# EAGLE design led (EAGLE 5.07)
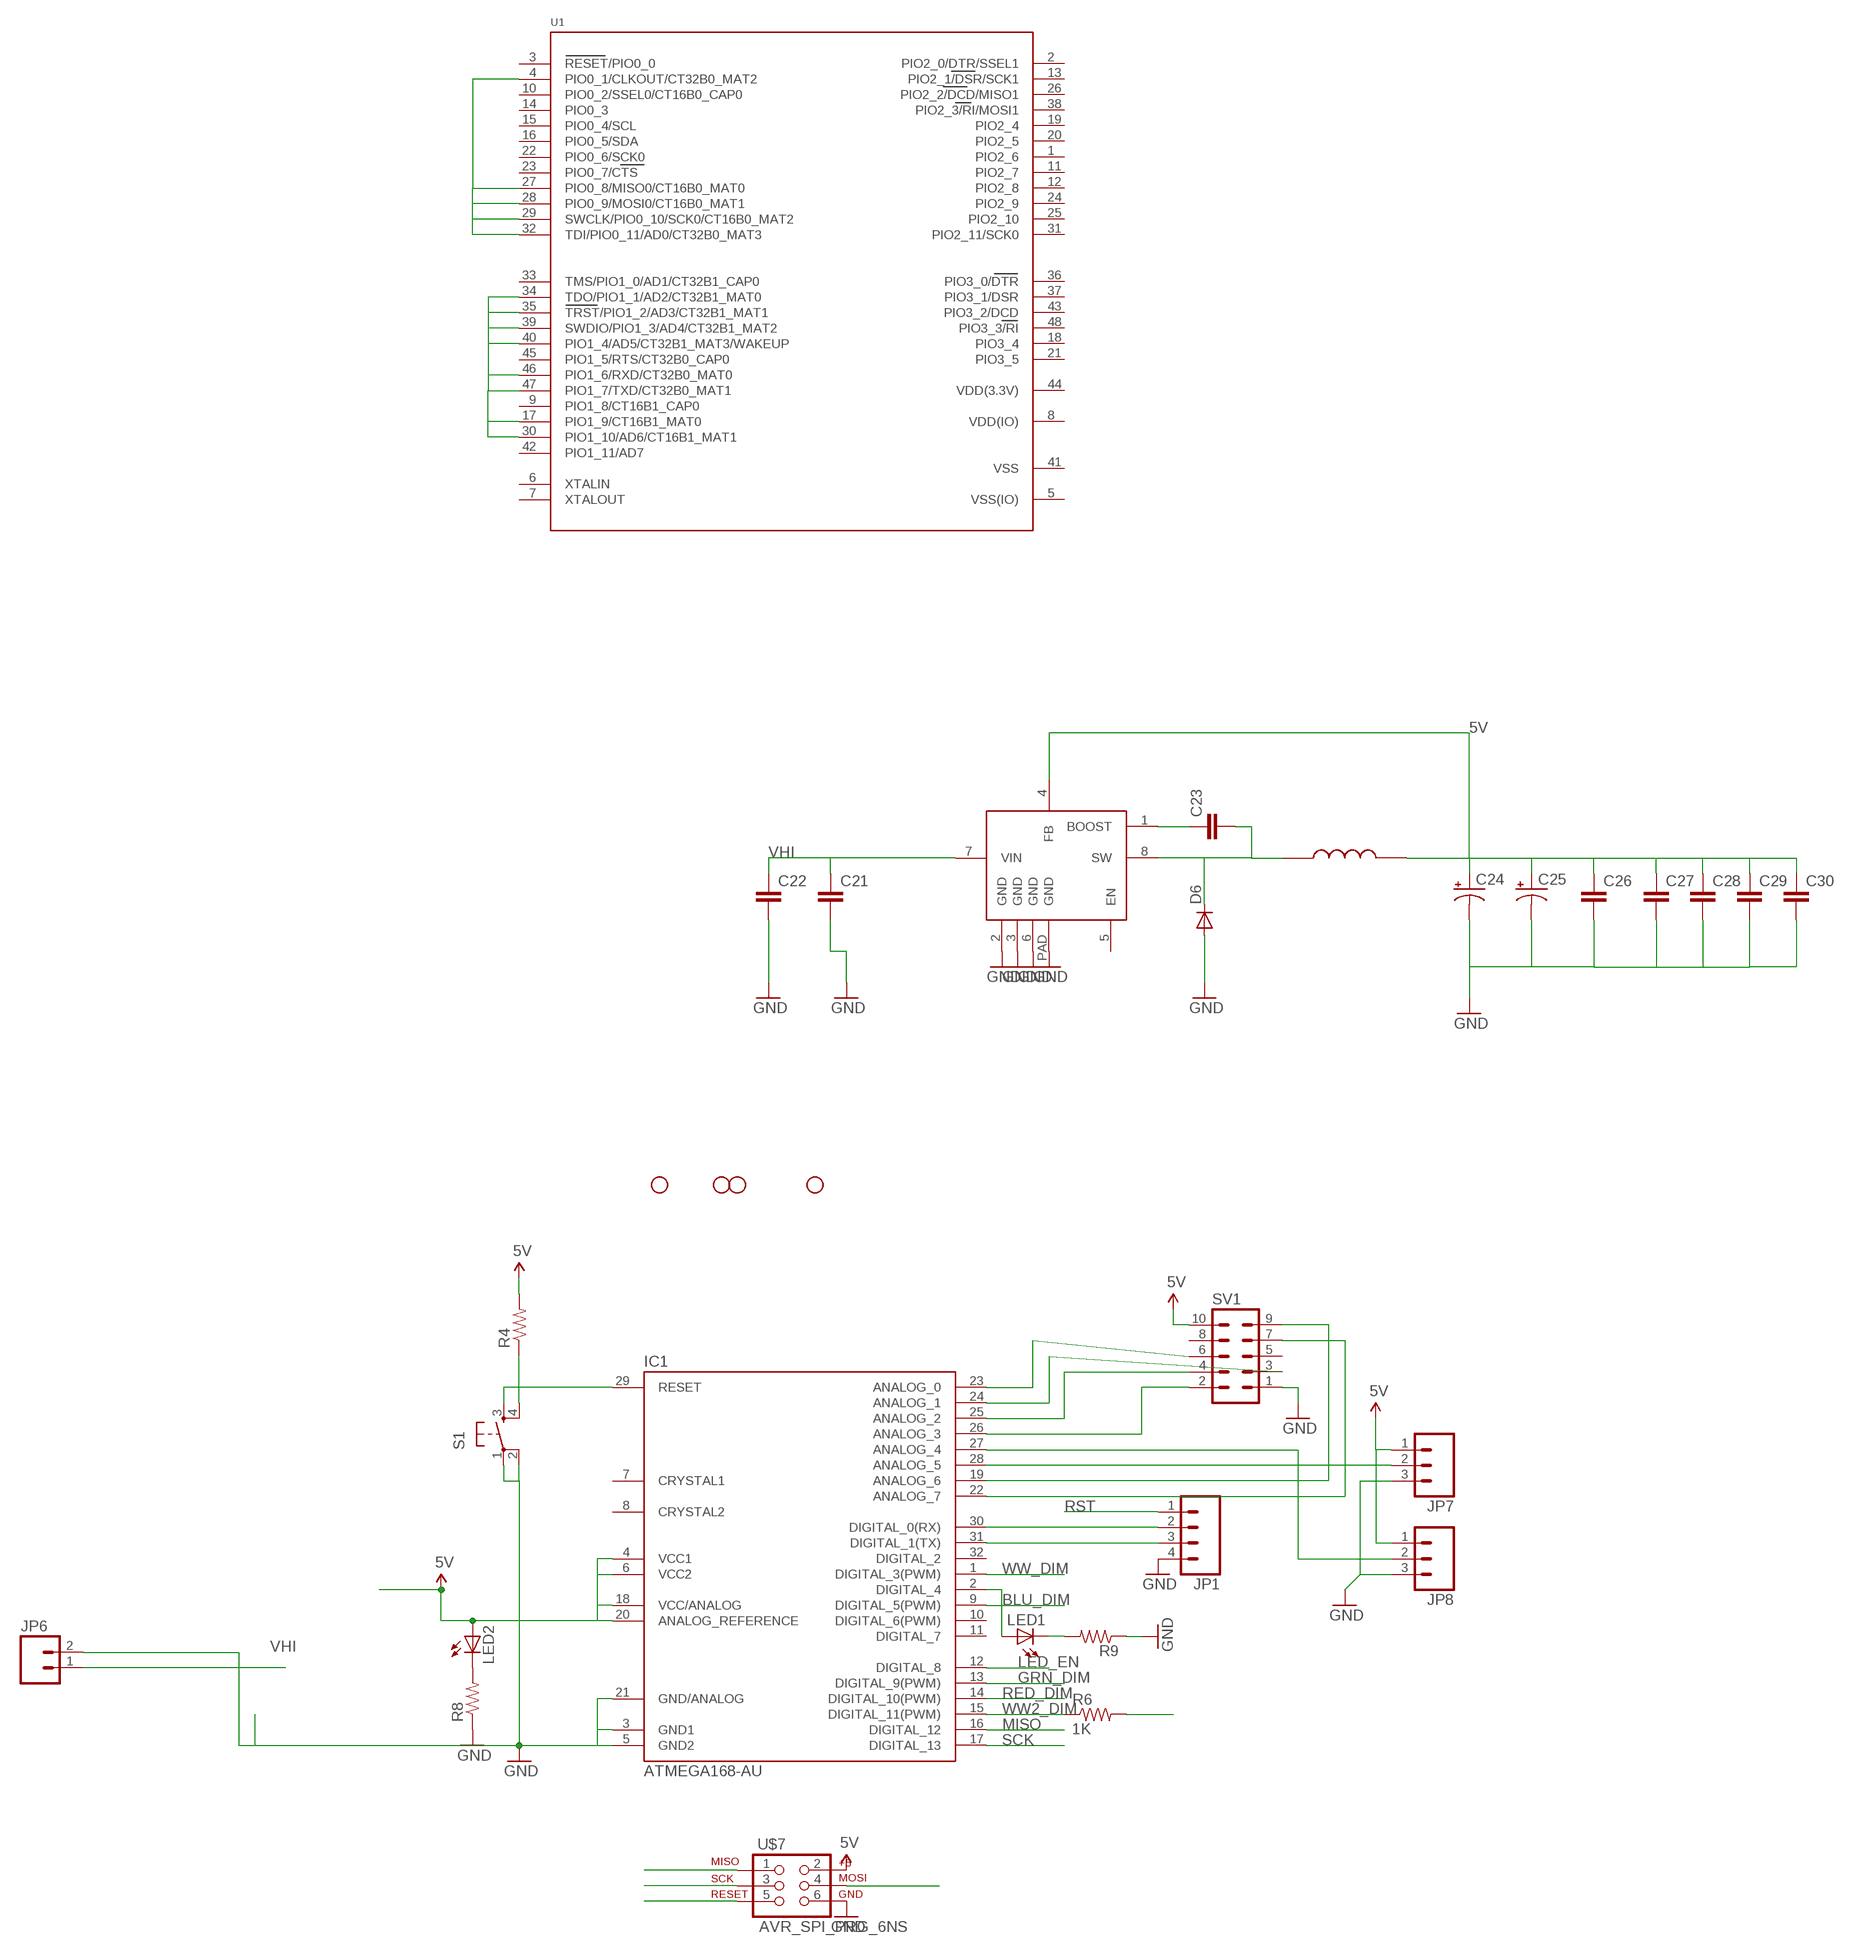
[diagram p0: schematic, sheet 1, part 1 of 2]
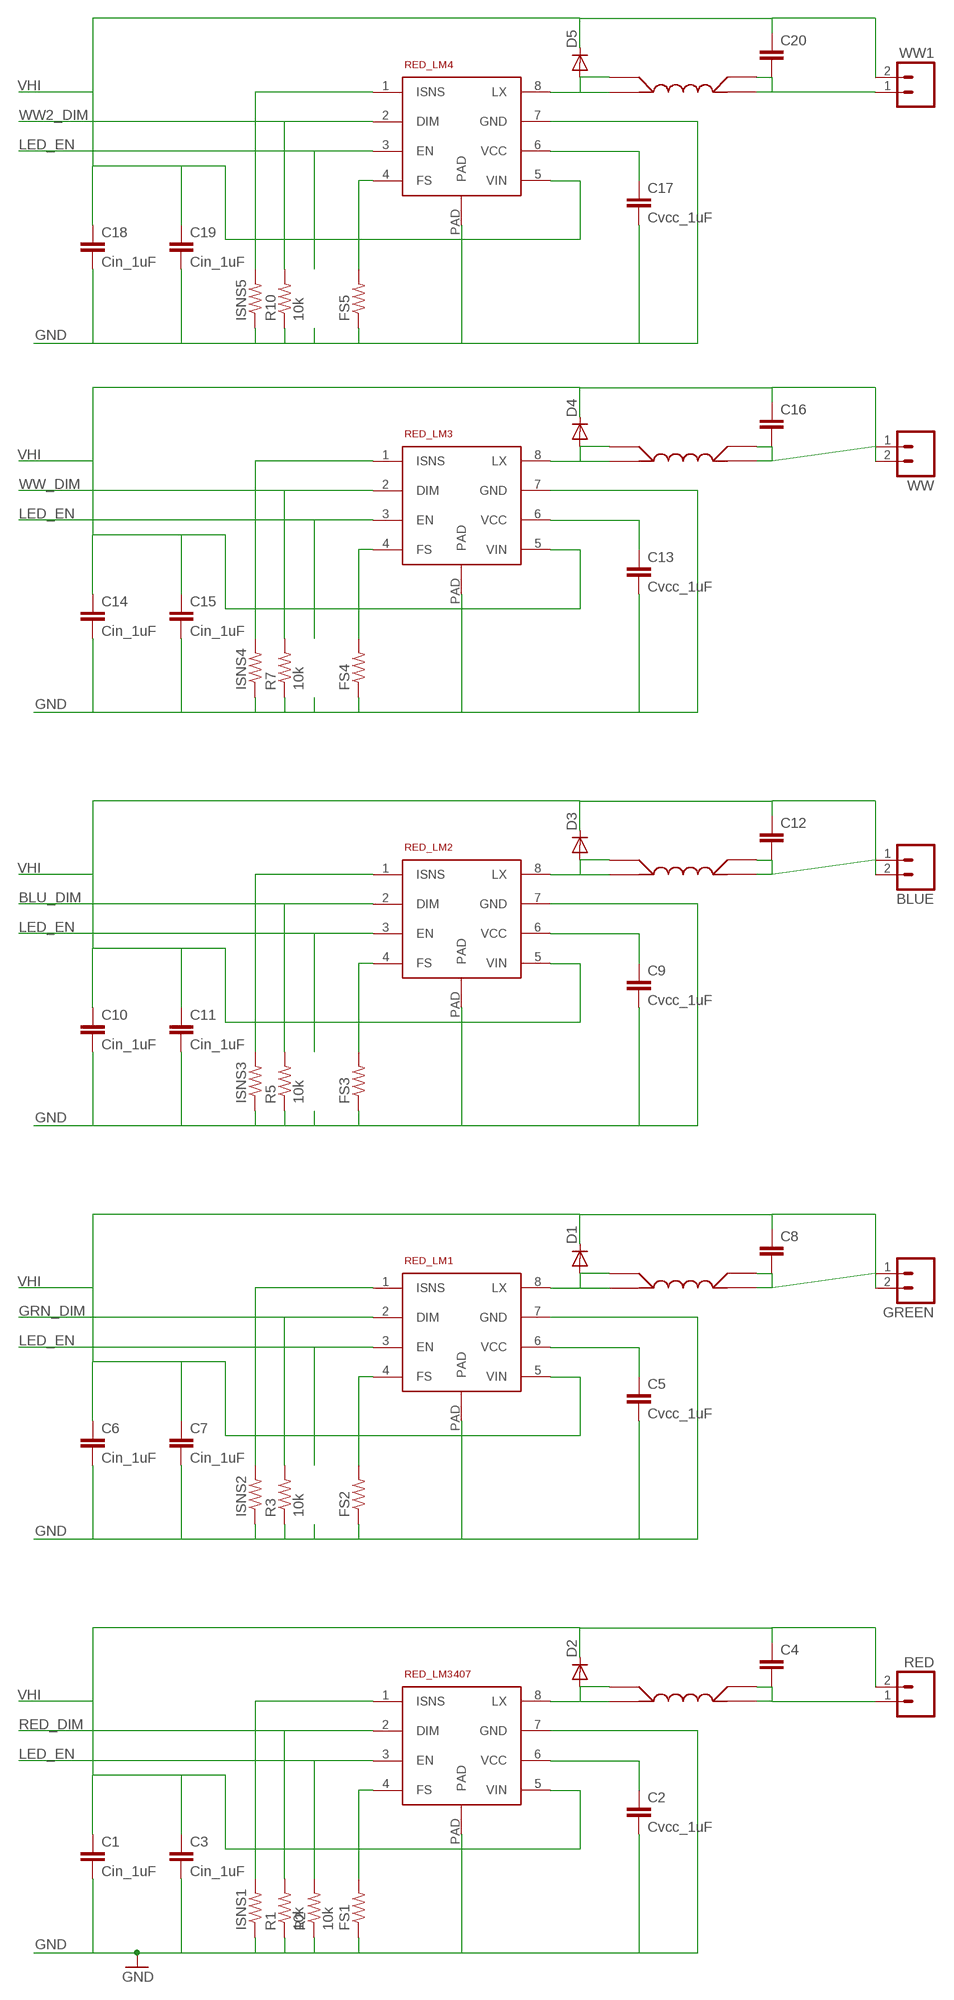
[diagram p1: schematic, sheet 1, part 2 of 2]

## Parts
BLUE  M023.5MM_LOCK  [SCREWTERMINAL-3.5MM-2_LOCK]
C1  Cin_1uF  C-EUC1206  [C1206]
C2  Cvcc_1uF  C-EUC1206  [C1206]
C3  Cin_1uF  C-EUC1206  [C1206]
C4  C-EUC1206  [C1206]
C5  Cvcc_1uF  C-EUC1206  [C1206]
C6  Cin_1uF  C-EUC1206  [C1206]
C7  Cin_1uF  C-EUC1206  [C1206]
C8  C-EUC1206  [C1206]
C9  Cvcc_1uF  C-EUC1206  [C1206]
C10  Cin_1uF  C-EUC1206  [C1206]
C11  Cin_1uF  C-EUC1206  [C1206]
C12  C-EUC1206  [C1206]
C13  Cvcc_1uF  C-EUC1206  [C1206]
C14  Cin_1uF  C-EUC1206  [C1206]
C15  Cin_1uF  C-EUC1206  [C1206]
C16  C-EUC1206  [C1206]
C17  Cvcc_1uF  C-EUC1206  [C1206]
C18  Cin_1uF  C-EUC1206  [C1206]
C19  Cin_1uF  C-EUC1206  [C1206]
C20  C-EUC1206  [C1206]
C21  C-EUC3216  [C3216]
C22  C-EUC0805  [C0805]
C23  C-EUC0805  [C0805]
C24  CAP_POL7343  [EIA7343]
C25  CAP_POLPTH1  [CPOL-RADIAL-100UF-25V]
C26  CAP0805  [0805]
C27  CAP0805  [0805]
C28  CAP0805  [0805]
C29  CAP0805  [0805]
C30  CAP0805  [0805]
D1  DIODESMA  [SMA-DIODE]
D2  DIODESMA  [SMA-DIODE]
D3  DIODESMA  [SMA-DIODE]
D4  DIODESMA  [SMA-DIODE]
D5  DIODESMA  [SMA-DIODE]
D6  DIODESMB  [SMB-DIODE]
FS1  RESISTOR  [0805]
FS2  RESISTOR  [0805]
FS3  RESISTOR  [0805]
FS4  RESISTOR  [0805]
FS5  RESISTOR  [0805]
GREEN  M023.5MM_LOCK  [SCREWTERMINAL-3.5MM-2_LOCK]
IC1  ATMEGA168-AU  [TQFP32-08]
ISNS1  RESISTOR  [0805]
ISNS2  RESISTOR  [0805]
ISNS3  RESISTOR  [0805]
ISNS4  RESISTOR  [0805]
ISNS5  RESISTOR  [0805]
JP1  M04LOCK  [1X04_LOCK]
JP2  STAND-OFF  [STAND-OFF]
JP3  STAND-OFF  [STAND-OFF]
JP4  STAND-OFF  [STAND-OFF]
JP5  STAND-OFF  [STAND-OFF]
JP6  M02  [1X02_LONGPADS]
JP7  M03LOCK_LONGPADS  [1X03_LOCK_LONGPADS]
JP8  M03LOCK_LONGPADS  [1X03_LOCK_LONGPADS]
LED1  LED5MM  [LED5MM]
LED2  LED5MM  [LED5MM]
R1  10k  RESISTOR  [0805]
R2  10k  RESISTOR  [0805]
R3  10k  RESISTOR  [0805]
R4  RESISTOR  [0805]
R5  10k  RESISTOR  [0805]
R6  1K  RESISTORPTH1  [AXIAL-0.3]
R7  10k  RESISTOR  [0805]
R8  RESISTOR  [0805]
R9  RESISTOR  [0805]
R10  10k  RESISTOR  [0805]
RED  M023.5MM_LOCK  [SCREWTERMINAL-3.5MM-2_LOCK]
RED_LM1  LM3407  [LM3407]
RED_LM2  LM3407  [LM3407]
RED_LM3  LM3407  [LM3407]
RED_LM4  LM3407  [LM3407]
RED_LM3407  LM3407  [LM3407]
S1  TAC_SWITCHPTH  [TACTILE-PTH]
SV1  ML10  [ML10]
U1  LPC1113/4  [LQFP48]
U$1  SRR4018  [SDR0805]
U$2  SRR4018  [SDR0805]
U$3  SRR4018  [SDR0805]
U$4  SRR4018  [SDR0805]
U$7  AVR_SPI_PRG_6NS  [2X3-NS]
U$11  SRR4018  [SDR0805]
U$13  LM22675  [PSOP-8]
U$14  INDUCTOR  [SRU1038]
WW  M023.5MM_LOCK  [SCREWTERMINAL-3.5MM-2_LOCK]
WW1  M023.5MM_LOCK  [SCREWTERMINAL-3.5MM-2_LOCK]

## Nets
5V: C24.A(+) C25.1(+) C26.1 C27.1 C28.1 C29.1 C30.1 IC1.4(VCC1) IC1.6(VCC2) IC1.18(VCC/ANALOG) IC1.20(ANALOG_REFERENCE) JP7.1 JP8.1 LED2.A R4.2 SV1.10 U$7.2 U$13.4(FB) U$14.P$2
AIN1: IC1.23(ANALOG_0) SV1.6
AIN2: IC1.24(ANALOG_1) SV1.3
AIN3: IC1.25(ANALOG_2) SV1.4
AIN4: IC1.26(ANALOG_3) SV1.2
BLU_DIM: IC1.9(DIGITAL_5(PWM)) R5.2 RED_LM2.2(DIM)
GND: C1.2 C2.2 C3.2 C5.2 C6.2 C7.2 C9.2 C10.2 C11.2 C13.2 C14.2 C15.2 C17.2 C18.2 C19.2 C21.2 C22.2 C24.C(-) C25.2(-) C26.2 C27.2 C28.2 C29.2 C30.2 D6.A FS1.1 FS2.1 FS3.1 FS4.1 FS5.1 IC1.3(GND1) IC1.5(GND2) IC1.21(GND/ANALOG) ISNS1.1 ISNS2.1 ISNS3.1 ISNS4.1 ISNS5.1 JP1.4 JP6.2 JP7.3 JP8.3 R1.1 R2.1 R3.1 R5.1 R7.1 R8.1 R9.1 R10.1 RED_LM1.7(GND) RED_LM1.PAD RED_LM2.7(GND) RED_LM2.PAD RED_LM3.7(GND) RED_LM3.PAD RED_LM4.7(GND) RED_LM4.PAD RED_LM3407.7(GND) RED_LM3407.PAD S1.1 S1.2 SV1.1 U$7.6 U$13.2(GND) U$13.3(GND) U$13.6(GND) U$13.PAD(GND)
GRN_DIM: IC1.13(DIGITAL_9(PWM)) R3.2 RED_LM1.2(DIM)
LED_EN: IC1.12(DIGITAL_8) R2.2 RED_LM1.3(EN) RED_LM2.3(EN) RED_LM3.3(EN) RED_LM4.3(EN) RED_LM3407.3(EN)
MISO: IC1.16(DIGITAL_12) U$7.1
MOSI: R6.P$2 U$7.4
N$1: C5.1 RED_LM1.6(VCC)
N$2: FS2.2 RED_LM1.4(FS)
N$3: C2.1 RED_LM3407.6(VCC)
N$4: ISNS2.2 RED_LM1.1(ISNS)
N$5: FS1.2 RED_LM3407.4(FS)
N$6: ISNS1.2 RED_LM3407.1(ISNS)
N$7: D2.A RED_LM3407.8(LX) U$2.1A U$2.1B
N$8: D1.A RED_LM1.8(LX) U$1.1A U$1.1B
N$9: U1.4(PIO0_1/CLKOUT/CT32B0_MAT2) U1.27(PIO0_8/MISO0/CT16B0_MAT0) U1.28(PIO0_9/MOSI0/CT16B0_MAT1) U1.29(SWCLK/PIO0_10/SCK0/CT16B0_MAT2) U1.32(TDI/PIO0_11/AD0/CT32B0_MAT3)
N$10: C8.2 GREEN.1 U$1.2A U$1.2B
N$11: C9.1 RED_LM2.6(VCC)
N$12: FS3.2 RED_LM2.4(FS)
N$13: ISNS3.2 RED_LM2.1(ISNS)
N$14: D3.A RED_LM2.8(LX) U$3.1A U$3.1B
N$15: BLUE.1 C12.2 U$3.2A U$3.2B
N$16: C13.1 RED_LM3.6(VCC)
N$17: FS4.2 RED_LM3.4(FS)
N$18: ISNS4.2 RED_LM3.1(ISNS)
N$19: D4.A RED_LM3.8(LX) U$4.1A U$4.1B
N$20: C16.2 U$4.2A U$4.2B WW.1
N$21: IC1.2(DIGITAL_4) LED1.A
N$22: LED2.K(C) R8.2
N$23: LED1.K(C) R9.2
N$24: IC1.31(DIGITAL_1(TX)) JP1.3
N$25: IC1.30(DIGITAL_0(RX)) JP1.2
N$26: C17.1 RED_LM4.6(VCC)
N$27: FS5.2 RED_LM4.4(FS)
N$28: ISNS5.2 RED_LM4.1(ISNS)
N$29: D5.A RED_LM4.8(LX) U$11.1A U$11.1B
N$30: U1.17(PIO1_9/CT16B1_MAT0) U1.30(PIO1_10/AD6/CT16B1_MAT1) U1.34(TDO/PIO1_1/AD2/CT32B1_MAT0) U1.35(TRST/PIO1_2/AD3/CT32B1_MAT1) U1.39(SWDIO/PIO1_3/AD4/CT32B1_MAT2) U1.40(PIO1_4/AD5/CT32B1_MAT3/WAKEUP) U1.46(PIO1_6/RXD/CT32B0_MAT0) U1.47(PIO1_7/TXD/CT32B0_MAT1)
N$31: IC1.19(ANALOG_6) SV1.9
N$32: IC1.22(ANALOG_7) SV1.7
N$33: C23.1 U$13.1(BOOST)
N$34: C23.2 D6.C U$13.8(SW) U$14.P$1
N$35: C20.2 U$11.2A U$11.2B WW1.1
N$36: C4.2 RED.1 U$2.2A U$2.2B
RED_DIM: IC1.14(DIGITAL_10(PWM)) R1.2 RED_LM3407.2(DIM)
RST: IC1.29(RESET) JP1.1 R4.1 S1.3 S1.4 U$7.5
SCK: IC1.17(DIGITAL_13) U$7.3
SW1: IC1.27(ANALOG_4) JP8.2
SW2: IC1.28(ANALOG_5) JP7.2
VHI: BLUE.2 C1.1 C3.1 C4.1 C6.1 C7.1 C8.1 C10.1 C11.1 C12.1 C14.1 C15.1 C16.1 C18.1 C19.1 C20.1 C21.1 C22.1 D1.C D2.C D3.C D4.C D5.C GREEN.2 JP6.1 RED.2 RED_LM1.5(VIN) RED_LM2.5(VIN) RED_LM3.5(VIN) RED_LM4.5(VIN) RED_LM3407.5(VIN) U$13.7(VIN) WW1.2 WW.2
WW2_DIM: IC1.15(DIGITAL_11(PWM)) R6.P$1 R10.2 RED_LM4.2(DIM)
WW_DIM: IC1.1(DIGITAL_3(PWM)) R7.2 RED_LM3.2(DIM)
Unconnected: IC1.7(CRYSTAL1) IC1.8(CRYSTAL2) IC1.10(DIGITAL_6(PWM)) IC1.11(DIGITAL_7) IC1.32(DIGITAL_2) SV1.5 SV1.8 U1.1(PIO2_6) U1.2(PIO2_0/DTR/SSEL1) U1.3(RESET/PIO0_0) U1.6(XTALIN) U1.7(XTALOUT) U1.9(PIO1_8/CT16B1_CAP0) U1.10(PIO0_2/SSEL0/CT16B0_CAP0) U1.11(PIO2_7) U1.12(PIO2_8) U1.13(PIO2_1/DSR/SCK1) U1.14(PIO0_3) U1.15(PIO0_4/SCL) U1.16(PIO0_5/SDA) U1.18(PIO3_4) U1.19(PIO2_4) U1.20(PIO2_5) U1.21(PIO3_5) U1.22(PIO0_6/SCK0) U1.23(PIO0_7/CTS) U1.24(PIO2_9) U1.25(PIO2_10) U1.26(PIO2_2/DCD/MISO1) U1.31(PIO2_11/SCK0) U1.33(TMS/PIO1_0/AD1/CT32B1_CAP0) U1.36(PIO3_0/DTR) U1.37(PIO3_1/DSR) U1.38(PIO2_3/RI/MOSI1) U1.42(PIO1_11/AD7) U1.43(PIO3_2/DCD) U1.45(PIO1_5/RTS/CT32B0_CAP0) U1.48(PIO3_3/RI) U$13.5(EN)

## Power pins joined to a net without a drawn wire
VDD(3.3V): U1.44(VDD(3.3V))
VDD(IO): U1.8(VDD(IO))
VSS: U1.41(VSS)
VSS(IO): U1.5(VSS(IO))

## Library data of the parts
BLUE GREEN JP6 RED WW WW1 = SparkFun:M02: Header 2 Standard 2-pin 0.1" header. Use with straight break away headers (SKU : PRT-00116), right angle break away headers (PRT-00553), swiss pins (PRT-00743), machine pins (PRT-00117), and female headers (PRT-00115). Molex polarized connector foot print use with SKU : PRT-08233 with associated crimp pins and housings.
C1-C3 C5-C7 C9-C11 C13-C15 C17-C19 = resistor:C-EU: CAPACITOR, European symbol
C4 C8 C12 C16 C20-C23 = rcl:C-EU: CAPACITOR, European symbol
C24 C25 = SparkFun:CAP_POL: Capacitor Polarized These are standard SMD and PTH capacitors. Normally 10uF, 47uF, and 100uF in electrolytic and tantalum varieties. Always verify the external diameter of the through hole cap, it varies with capacity, voltage, and manufacturer. The EIA devices should be standard.
C26-C30 = SparkFun:CAP: Capacitor Standard 0603 ceramic capacitor, and 0.1" leaded capacitor.
D1-D6 = SparkFun:DIODE: Diode These are standard reverse protection diodes and small signal diodes. SMA package can handle up to about 1A. SOD-323 can handle about 200mA. What the SOD-323 package when ordering, there are some mfgs out there that are 5-pin packages.
FS1-FS5 ISNS1-ISNS5 R1-R10 = SparkFun:RESISTOR: Resistor Basic schematic elements and footprints for 0603, 1206, and PTH 1/10th watt (small) resistors.
IC1 = Arduino-AVR:ATMEGA168
JP1 = SparkFun:M04: Header 4 Standard 4-pin 0.1" header. Use with straight break away headers (SKU : PRT-00116), right angle break away headers (PRT-00553), swiss pins (PRT-00743), machine pins (PRT-00117), and female headers (PRT-00115). Molex polarized connector foot print use with SKU : PRT-08231 with associated crimp pins and housings.
JP2-JP5 = SparkFun:STAND-OFF: Stand Off This is the mechanical footprint for a #4 phillips button head screw. Use the keepout ring to avoid running the screw head into surrounding components. SKU : PRT-00447
JP7 JP8 = SparkFun:M03: Header 3 Standard 3-pin 0.1" header. Use with straight break away headers (SKU : PRT-00116), right angle break away headers (PRT-00553), swiss pins (PRT-00743), machine pins (PRT-00117), and female headers (PRT-00115). Molex polarized connector foot print use with SKU : PRT-08232 with associated crimp pins and housings.
LED1 LED2 = SparkFun:LED: LEDs Standard schematic elements and footprints for 5mm, 3mm, 1206, and 0603 sized LEDs. 5mm - Spark Fun Electronics SKU : COM-00529 (and others)
RED_LM1-RED_LM4 RED_LM3407 = JoesCustom:LM3407
S1 = SparkFun:TAC_SWITCH: Momentary Switch Button commonly used for reset or general input. Spark Fun Electronics SKU : COM-00097
SV1 = con-harting-ml:ML10: HARTING
U1 = microbuilder:LPC1113/4: LPC1113/4 MCU QFP48 Package ARM Cortex M0, 50MHz Operation, 8 Channel 10-Bit ADC, 1²C, 2xSPI, UART, 2x16 Bit and 2x32 Bit Timers, Internal 12MHz Oscillator, 1.8-3.6V operation. Model Flash SRAM Part N°: Digikey # LPC1113 24KB 8KB LPC1113FBD48/301 TBD LPC1114 32KB 8KB LPC1114FBD48/301 TBD
U$1-U$4 U$11 = JoesCustom:SRR4018
U$7 = SparkFun:AVR_SPI_PRG_6: AVR ISP 6 Pin This is the reduced ISP connector for AVR programming. Common on Arduino. This footprint will take up less PCB space and can be used with a 10-pin to 6-pin adapter such as SKU: BOB-08508
U$13 = JoesCustom:LM22675
U$14 = JoesCustom:INDUCTOR

## Board
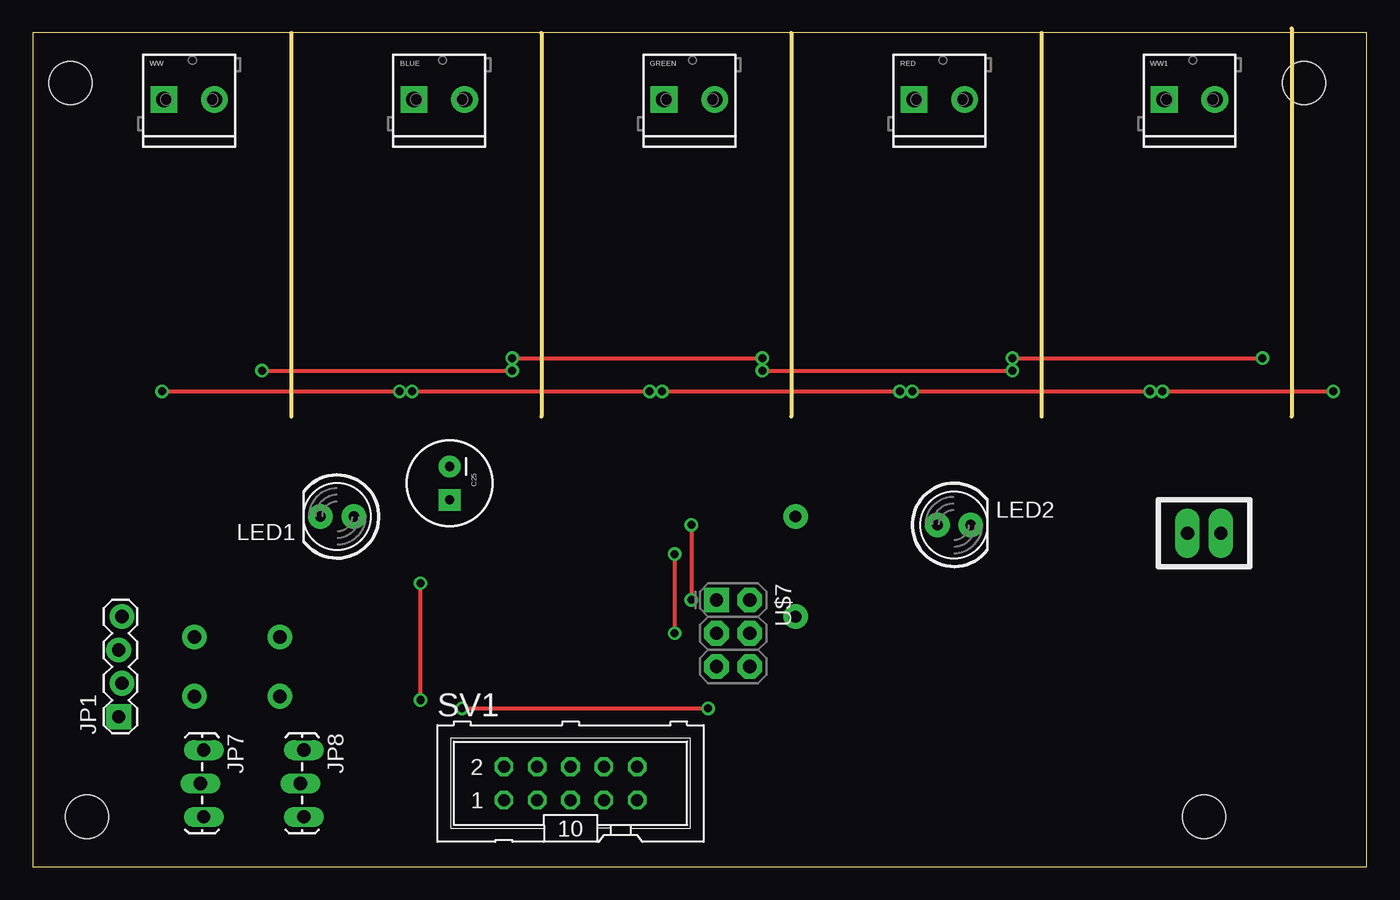
[diagram p2: board, top side]
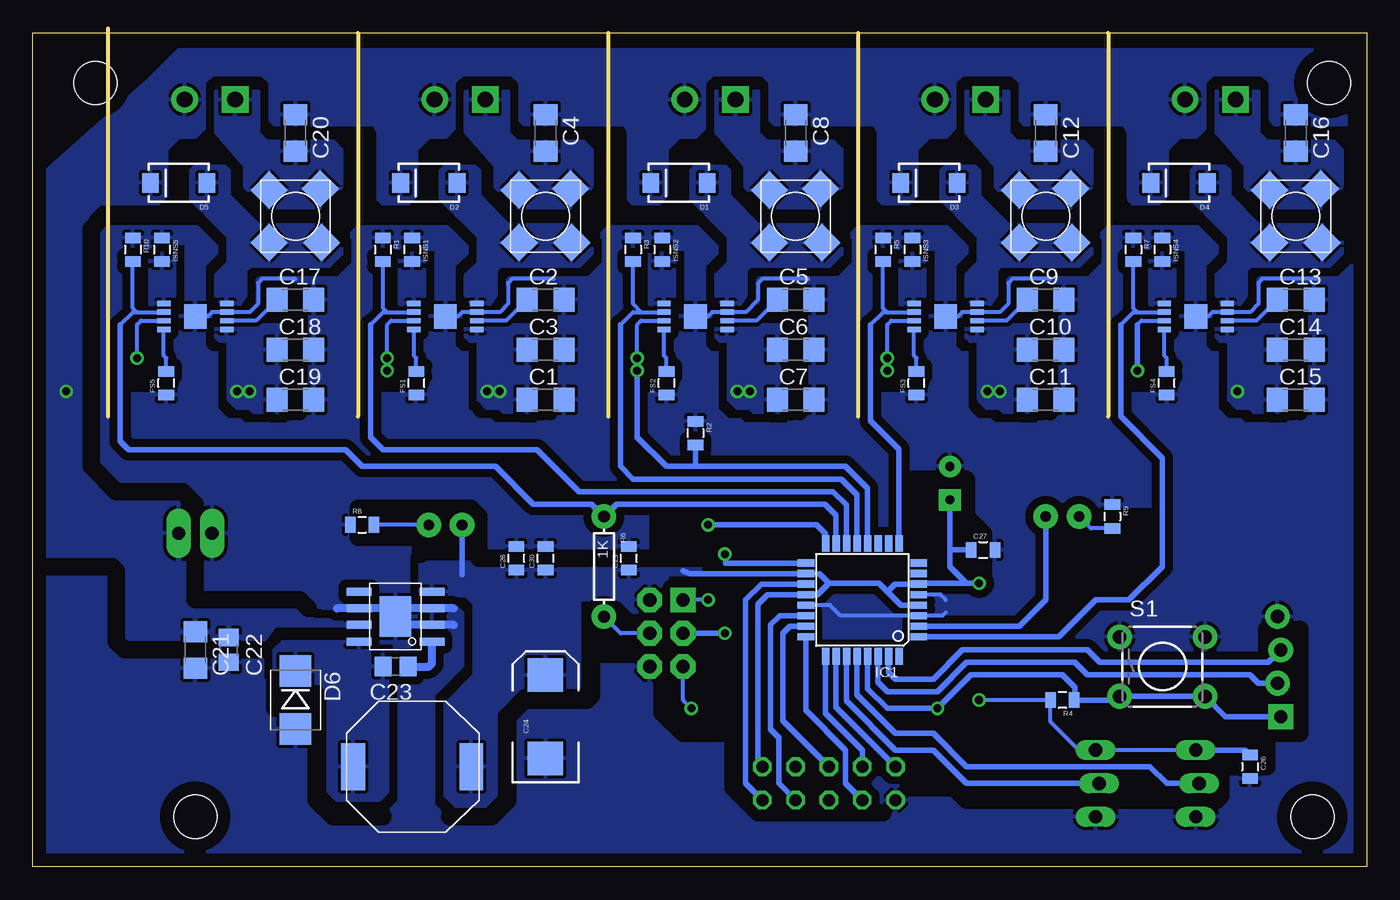
[diagram p3: board, bottom side, seen from below]

Size 101.6 x 63.5 mm. Coordinates in mm from the lower left corner, seen from the top.
Outline: 0,0 101.6,0 101.6,63.5 0,63.5 0,0
Copper layers (1*16): Top 0.035mm / dielectric 1.5mm / Bottom 0.035mm
Design rules "default *": minimum track width 10mil, minimum drill 24mil, track to track 12mil, track to pad 8mil, pad to pad 8mil, via to via 12mil, smd to smd 8mil, copper to edge 40mil, drill to drill 8mil, minimum pad ring 10mil, minimum via ring 8mil, stop-mask expansion 4mil, vias tented up to drill 0mil, thermal gap 10mil
bRestrict: area 81.3,34.6 to 81.9,43.8; area 62.2,34.6 to 62.9,43.8; area 43.2,34.6 to 43.8,43.8; area 24.1,34.6 to 24.8,43.8; area 5.1,34.6 to 5.7,43.8; 78 lines
Milling: 5 lines

### Footprints (pad centres in the part's own frame; a part is rotated, then mirrored left to right if it is on the bottom)
SCREWTERMINAL-3.5MM-2_LOCK = drill 1.2 pad 2.032 square: 1 -0.178,0 | drill 1.2 pad 2.032 round: 2 3.678,0
C1206 = smd 1.6 x 1.8: 1 -1.4,0; 2 1.4,0
C3216 = smd 1.6 x 1.8: 1 -1.4,0; 2 1.4,0
C0805 = smd 1.3 x 1.5: 1 -0.95,0; 2 0.95,0
EIA7343 = smd 2.55 x 2.7: A 3.17,0; C -3.17,0
CPOL-RADIAL-100UF-25V = drill 0.7 pad 1.651 square: 1 1.27,0 | drill 0.7 pad 1.651 round: 2 -1.27,0
0805 = smd 0.8 x 1.2: 1 -0.9,0; 2 0.9,0
SMA-DIODE = smd 1.27 x 1.47: A -2.15,0; C 2.15,0
SMB-DIODE = smd 2.4 x 2.4: A 2.2,0; C -2.2,0
TQFP32-08 = smd 1.27 x 0.559: 1 -4.293,2.8; 2 -4.293,2; 3 -4.293,1.2; 4 -4.293,0.4; 5 -4.293,-0.4; 6 -4.293,-1.2; 7 -4.293,-2; 8 -4.293,-2.8; 17 4.293,-2.8; 18 4.293,-2; 19 4.293,-1.2; 20 4.293,-0.4; 21 4.293,0.4; 22 4.293,1.2; 23 4.293,2; 24 4.293,2.8 | smd 0.559 x 1.27: 9 -2.8,-4.293; 10 -2,-4.293; 11 -1.2,-4.293; 12 -0.4,-4.293; 13 0.4,-4.293; 14 1.2,-4.293; 15 2,-4.293; 16 2.8,-4.293; 25 2.8,4.293; 26 2,4.293; 27 1.2,4.293; 28 0.4,4.293; 29 -0.4,4.293; 30 -1.2,4.293; 31 -2,4.293; 32 -2.8,4.293
1X04_LOCK = drill 1.016 pad 1.88 square: 1 0,0.127 | drill 1.016 pad 1.88 round: 2 2.54,-0.127; 3 5.08,0.127; 4 7.62,-0.127
STAND-OFF = hole 3.302: 0,0
1X02_LONGPADS = drill 1.016 pad 1.88 long: 1 0,0; 2 2.54,0
1X03_LOCK_LONGPADS = drill 1.016 long: 1 0,0; 2 2.54,-0.254; 3 5.08,0
LED5MM = drill 0.813 pad 1.88 round: A -1.27,0; K 1.27,0
AXIAL-0.3 = drill 0.9 pad 1.88 round: P$1 -3.81,0; P$2 3.81,0
LM3407 = smd 0.406 x 1.016: 1 -0.991,-2.4; 2 -0.33,-2.4; 3 0.33,-2.4; 4 0.991,-2.4; 5 0.991,2.4; 6 0.33,2.4; 7 -0.33,2.4; 8 -0.991,2.4 | smd 1.854 x 1.727: PAD 0,0
TACTILE-PTH = drill 1.016 pad 1.88 round: 1 -3.251,2.261; 2 3.251,2.261; 3 -3.251,-2.261; 4 3.251,-2.261
ML10 = drill 0.914 octagon: 1 -5.08,-1.27; 2 -5.08,1.27; 3 -2.54,-1.27; 4 -2.54,1.27; 5 0,-1.27; 6 0,1.27; 7 2.54,-1.27; 8 2.54,1.27; 9 5.08,-1.27; 10 5.08,1.27
LQFP48 = smd 1.5 x 0.25: 1 -4.3,2.75; 2 -4.3,2.25; 3 -4.3,1.75; 4 -4.3,1.25; 5 -4.3,0.75; 6 -4.3,0.25; 7 -4.3,-0.25; 8 -4.3,-0.75; 9 -4.3,-1.25; 10 -4.3,-1.75; 11 -4.3,-2.25; 12 -4.3,-2.75; 25 4.3,-2.75; 26 4.3,-2.25; 27 4.3,-1.75; 28 4.3,-1.25; 29 4.3,-0.75; 30 4.3,-0.25; 31 4.3,0.25; 32 4.3,0.75; 33 4.3,1.25; 34 4.3,1.75; 35 4.3,2.25; 36 4.3,2.75 | smd 0.25 x 1.5: 13 -2.75,-4.3; 14 -2.25,-4.3; 15 -1.75,-4.3; 16 -1.25,-4.3; 17 -0.75,-4.3; 18 -0.25,-4.3; 19 0.25,-4.3; 20 0.75,-4.3; 21 1.25,-4.3; 22 1.75,-4.3; 23 2.25,-4.3; 24 2.75,-4.3; 37 2.75,4.3; 38 2.25,4.3; 39 1.75,4.3; 40 1.25,4.3; 41 0.75,4.3; 42 0.25,4.3; 43 -0.25,4.3; 44 -0.75,4.3; 45 -1.25,4.3; 46 -1.75,4.3; 47 -2.25,4.3; 48 -2.75,4.3
SDR0805 = smd 2 x 2 rotated 45: 1A -2,2; 1B 2,2; 2A -1.9,-2.1; 2B 2,-2
2X3-NS = drill 1.016 pad 1.88 square: 1 -2.54,-1.27 | drill 1.016 pad 1.88 octagon: 2 -2.54,1.27; 3 0,-1.27; 4 0,1.27; 5 2.54,-1.27; 6 2.54,1.27
PSOP-8 = smd 0.61 x 1.905: 1 -1.905,-2.781; 2 -0.635,-2.781; 3 0.635,-2.781; 4 1.905,-2.781; 5 1.905,2.781; 6 0.635,2.781; 7 -0.635,2.781; 8 -1.905,2.781 | smd 3.099 x 2.413: PAD 0,0
SRU1038 = smd 1.8 x 3.6: P$1 -4.5,0; P$2 4.5,0

### Placement (x,y rotation side)
BLUE  29.21,58.42 0 top
C1  62.55,35.56 0 bottom
C2  62.55,43.18 0 bottom
C3  62.55,39.37 0 bottom
C4  62.55,55.88 270 bottom
C5  43.5,43.18 0 bottom
C6  43.5,39.37 0 bottom
C7  43.5,35.56 0 bottom
C8  43.5,55.88 270 bottom
C9  24.45,43.18 0 bottom
C10  24.45,39.37 0 bottom
C11  24.45,35.56 0 bottom
C12  24.45,55.88 270 bottom
C13  5.4,43.18 0 bottom
C14  5.4,39.37 0 bottom
C15  5.4,35.56 0 bottom
C16  5.4,55.88 270 bottom
C17  81.6,43.18 0 bottom
C18  81.6,39.37 0 bottom
C19  81.6,35.56 0 bottom
C20  81.6,55.88 270 bottom
C21  89.22,16.51 270 bottom
C22  86.68,16.51 270 bottom
C23  73.98,15.24 180 bottom
C24  62.55,11.43 90 bottom
C25  31.75,29.21 270 top
C26  8.89,7.62 270 bottom
C27  29.21,24.13 0 bottom
C28  64.77,23.5 90 bottom
C29  56.2,23.5 90 bottom
C30  62.55,23.5 90 bottom
D1  52.39,52.07 180 bottom
D2  71.44,52.07 180 bottom
D3  33.34,52.07 180 bottom
D4  14.29,52.07 180 bottom
D5  90.49,52.07 180 bottom
D6  81.6,12.7 270 bottom
FS1  72.39,36.83 90 bottom
FS2  53.34,36.83 90 bottom
FS3  34.29,36.83 90 bottom
FS4  15.24,36.83 90 bottom
FS5  91.44,36.83 90 bottom
GREEN  48.26,58.42 0 top
IC1  38.42,20.32 180 bottom
ISNS1  72.71,46.99 270 bottom
ISNS2  53.66,46.99 270 bottom
ISNS3  34.61,46.99 270 bottom
ISNS4  15.56,46.99 270 bottom
ISNS5  91.76,46.99 270 bottom
JP1  6.67,11.43 90 top
JP2  89.22,3.81 0 bottom
JP3  96.84,59.69 0 bottom
JP4  4.13,3.81 0 bottom
JP5  2.86,59.69 0 bottom
JP6  90.49,25.4 0 bottom
JP7  13.02,8.89 270 top
JP8  20.64,8.89 270 top
LED1  23.18,26.67 180 top
LED2  70.17,26.04 0 top
R1  74.93,46.99 270 bottom
R2  51.12,33.02 270 bottom
R3  55.88,46.99 270 bottom
R4  23.18,12.7 180 bottom
R5  36.83,46.99 270 bottom
R6  58.1,22.86 270 bottom
R7  17.78,46.99 270 bottom
R8  76.52,26.04 0 bottom
R9  19.37,26.67 270 bottom
R10  93.98,46.99 270 bottom
RED  67.31,58.42 0 top
RED_LM1  51.12,41.91 270 bottom
RED_LM2  32.07,41.91 270 bottom
RED_LM3  13.02,41.91 270 bottom
RED_LM4  89.22,41.91 270 bottom
RED_LM3407  70.17,41.91 270 bottom
S1  15.56,15.24 0 bottom
SV1  40.96,6.35 0 top
U1  -8.89,7.62 0 top  (outside the outline)
U$1  43.5,49.53 180 bottom
U$2  62.55,49.53 180 bottom
U$3  24.45,49.53 180 bottom
U$4  5.4,49.53 180 bottom
U$7  53.34,17.78 270 top
U$11  81.6,49.53 180 bottom
U$13  73.98,19.05 90 bottom
U$14  72.71,7.62 0 bottom
WW  10.16,58.42 0 top
WW1  86.36,58.42 0 top

### Tracks (layer width: path | path; a pad name or v marks a point on that pad's centre or on a via)
5V  (via drill 0.61)
  Top 0.305: v29.53,12.7 v29.53,21.59
  Bottom 0.305: 41.69,22.32 IC1.18 | 34.05,21.59 IC1.6 | v29.53,12.7 R4.2 24.08,11.06 21.91,8.89 JP8.1 JP7.1
  Bottom 0.406: 40.96,21.59 41.69,22.32 | IC1.4 35.48,19.92 36.51,20.95 | IC1.6 35.95,21.52 36.51,20.95 | 40.96,21.59 41.83,20.72 IC1.20 45.64,20.72 46.35,20 46.35,7.94 SV1.10 | 40.96,21.59 37.15,21.59 36.51,20.95 | v29.53,21.59 30.48,21.59 | 30.48,21.59 34.05,21.59 | JP7.1 9.26,8.89 C26.1 | 31.75,24.13 31.75,22.86 30.48,21.59 | 31.75,24.13 C25.1 | 31.75,24.13 C27.1 | 68.9,22.23 LED2.A | IC1.18 51.53,22.32 52.07,22.54
  pour Bottom (isolate 0.61): 72.07,20.95 72.07,23.18 50.8,23.18 50.8,22.23 53.34,22.23 53.34,19.68 53.66,19.37 55.88,19.37 56.83,20.32 60.01,20.32 60.01,13.65 64.45,13.65 66.36,11.75 66.36,5.4 67.31,4.45 69.22,4.45 70.17,5.4 70.17,12.38 67.94,14.61 67.94,20 68.58,20.64 71.75,20.64
AIN1
  Bottom 0.406: IC1.23 43.91,18.32 44.45,17.78 44.45,11.11 SV1.6
AIN2
  Bottom 0.406: IC1.24 42.71,11.91 39.69,8.89 39.69,6.35 SV1.3
AIN3
  Bottom 0.406: IC1.25 41.22,11.69 38.42,8.89 SV1.4
AIN4
  Bottom 0.406: IC1.26 40.42,12.16 SV1.2
BLU_DIM
  Bottom 0.305: 36.52,42.24 36.83,42.55 R5.2 | 36.52,42.24 36.82,42.24 37.78,41.27 | 36.52,42.24 RED_LM2.2
  Bottom 0.406: IC1.9 35.62,31.81 37.78,33.97 37.78,41.27
GND
  Bottom 0.305: IC1.5 32.47,20.72 32.07,20.32 | 32.07,19.37 32.31,19.12 IC1.3 40.08,19.12 40.88,19.92 IC1.21 | RED_LM4.PAD 88.27,41.91 87.95,42.23 86.81,42.23 | 86.81,42.23 86.68,42.23 | 86.81,42.23 RED_LM4.7 85.08,42.24 84.45,42.86 84.45,44.45 84.14,44.77 81.6,44.77 | RED_LM3407.PAD 69.22,41.91 68.89,42.24 RED_LM3407.7 66.03,42.24 65.41,42.86 65.41,44.45 65.09,44.77 61.91,44.77 | RED_LM1.PAD 50.16,41.91 49.85,42.23 48.73,42.23 RED_LM1.7 47.3,42.24 46.35,43.18 46.35,44.45 46.04,44.77 42.55,44.77 | RED_LM2.PAD 31.11,41.91 30.8,42.23 29.68,42.23 | 29.68,42.23 RED_LM2.7 | RED_LM3.PAD 12.06,41.91 11.75,42.23 10.63,42.23 RED_LM3.7 8.88,42.24 8.26,42.86 8.26,44.45 7.94,44.77 3.81,44.77 | 73.03,18.41 73.34,18.41 U$13.PAD 74.61,19.68 | 29.68,42.23 27.94,42.23 27.3,42.86 27.3,44.45 26.99,44.77 24.13,44.77
  Bottom 0.61: 69.53,19.68 73.03,19.68 | 69.53,18.41 73.03,18.41 | 74.61,19.68 U$13.6 78.42,19.68
  pour Bottom (isolate 0.61, rank 2): 0,63.5 0,0 101.6,0 101.6,63.5
GRN_DIM
  Bottom 0.305: 55.26,42.24 55.88,42.86 R3.2 | 55.26,42.24 55.87,42.24 56.83,41.27 | 55.26,42.24 RED_LM1.2
  Bottom 0.406: 56.83,41.27 56.83,30.48 55.88,29.53 40.01,29.53 38.82,28.34 IC1.13
LED_EN  (via drill 0.61)
  Top 0.305: v36.51,38.73 v55.56,38.73 | v74.61,38.73 v93.66,38.73 | v55.56,37.78 v74.61,37.78 | v17.46,37.78 v36.51,37.78
  Bottom 0.305: RED_LM4.3 93.36,41.58 93.66,41.27 v93.66,38.73 | RED_LM3407.3 74.31,41.58 74.61,41.27 v74.61,38.73 v74.61,37.78 | RED_LM1.3 55.26,41.58 55.56,41.27 v55.56,38.73 v55.56,37.78 | RED_LM2.3 36.21,41.58 36.51,41.27 v36.51,38.73 v36.51,37.78 | RED_LM3.3 17.16,41.58 17.46,41.27
  Bottom 0.406: IC1.12 38.02,28.81 39.69,30.48 51.12,30.48 | 51.12,30.48 53.34,30.48 55.56,32.7 v55.56,37.78 | 51.12,30.48 R2.2 | v17.46,37.78 17.46,41.27
MISO  (via drill 0.61)
  Top 0.305: v50.16,26.04 v50.16,20.32
  Bottom 0.305: v50.16,20.32 U$7.1
  Bottom 0.406: IC1.16 41.22,25.34 41.91,26.04 v50.16,26.04
MOSI
  Bottom 0.305: R6.P$2 56.83,17.78 U$7.4
N$1
  Bottom 0.305: RED_LM1.6 46.5,41.58 C5.1
N$2
  Bottom 0.305: RED_LM1.4 53.52,38.91 53.34,38.73 FS2.2
N$3
  Bottom 0.305: RED_LM3407.6 65.55,41.58 C2.1
N$4
  pour Bottom (isolate 0.305): 53.34,42.86 52.7,43.5 52.7,46.67 54.61,46.67 54.61,42.86 54.29,42.55
N$5
  Bottom 0.305: RED_LM3407.4 72.57,38.91 72.39,38.73 FS1.2
N$6
  pour Bottom (isolate 0.305): 72.39,42.86 71.75,43.5 71.75,46.67 73.66,46.67 73.66,42.86 73.34,42.55
N$7
  pour Bottom (isolate 0.305): 65.41,48.9 60.33,48.9 59.05,47.62 59.05,46.67 60.01,45.72 66.04,45.72 66.36,45.4 66.36,43.5 66.99,42.55 67.94,42.55 68.58,43.5 68.58,45.09 67.63,46.04 67.63,47.94 70.48,50.8 70.48,53.02 70.17,53.34 67.94,53.34 67.63,53.02 67.63,51.12
N$8
  pour Bottom (isolate 0.305): 46.35,48.9 41.27,48.9 40.01,47.62 40.01,46.67 40.96,45.72 46.99,45.72 47.31,45.4 47.31,43.5 47.94,42.55 48.9,42.55 49.53,43.5 49.53,45.09 48.58,46.04 48.58,47.94 51.44,50.8 51.44,53.02 51.12,53.34 48.9,53.34 48.58,53.02 48.58,51.12
N$9  (4 unrouted)
N$10
  pour Bottom (isolate 0.305): 41.59,50.16 45.72,50.16 47.31,51.75 47.31,53.34 49.53,55.88 49.53,59.05 46.35,59.05 46.35,55.88 45.72,55.24 40.64,55.24 40.01,54.61 40.01,51.75
N$11
  Bottom 0.305: RED_LM2.6 27.45,41.58 C9.1
N$12
  Bottom 0.305: RED_LM2.4 34.47,38.91 34.29,38.73 FS3.2
N$13
  pour Bottom (isolate 0.305): 34.29,42.86 33.66,43.5 33.66,46.67 35.56,46.67 35.56,42.86 35.24,42.55
N$14
  pour Bottom (isolate 0.305): 27.3,48.9 22.23,48.9 20.95,47.62 20.95,46.67 21.91,45.72 27.94,45.72 28.26,45.4 28.26,43.5 28.89,42.55 29.84,42.55 30.48,43.5 30.48,45.09 29.53,46.04 29.53,47.94 32.38,50.8 32.38,53.02 32.07,53.34 29.84,53.34 29.53,53.02 29.53,51.12
N$15
  pour Bottom (isolate 0.406): 22.54,50.16 26.67,50.16 28.26,51.75 28.26,53.34 30.48,55.88 30.48,59.05 27.3,59.05 27.3,55.88 26.67,55.24 21.59,55.24 20.95,54.61 20.95,51.75
N$16
  Bottom 0.305: RED_LM3.6 8.4,41.58 C13.1
N$17
  Bottom 0.305: RED_LM3.4 15.42,38.91 15.24,38.73 FS4.2
N$18
  pour Bottom (isolate 0.305): 15.24,42.86 14.61,43.5 14.61,46.67 16.51,46.67 16.51,42.86 16.19,42.55
N$19
  pour Bottom (isolate 0.305): 8.26,48.9 3.17,48.9 1.91,47.62 1.91,46.67 2.86,45.72 8.89,45.72 9.21,45.4 9.21,43.5 9.84,42.55 10.79,42.55 11.43,43.5 11.43,45.09 10.48,46.04 10.48,47.94 13.34,50.8 13.34,53.02 13.02,53.34 10.79,53.34 10.48,53.02 10.48,51.12
N$20
  pour Bottom (isolate 0.406): 3.49,50.16 7.62,50.16 9.21,51.75 9.21,53.34 11.43,55.88 11.43,59.05 8.26,59.05 8.26,55.88 7.62,55.24 2.54,55.24 1.91,54.61 1.91,51.75
N$21
  Bottom 0.406: IC1.2 26.45,18.32 24.45,20.32 LED1.A
N$22
  Bottom 0.305: LED2.K R8.2
N$23
  Bottom 0.305: R9.2 21.01,25.77 LED1.K
N$24
  Bottom 0.406: IC1.31 36.42,14.83 35.88,14.29 33.02,14.29 30.8,16.51 21.27,16.51 20.32,15.56 7.49,15.56 JP1.3
N$25
  Bottom 0.406: IC1.30 37.22,14.04 36.51,13.34 32.7,13.34 30.48,15.56 22.23,15.56 21.27,14.61 8.89,14.61 8.26,13.97 JP1.2
N$26
  Bottom 0.305: RED_LM4.6 84.6,41.58 C17.1
N$27
  Bottom 0.305: RED_LM4.4 91.62,38.91 91.44,38.73 FS5.2
N$28
  pour Bottom (isolate 0.305): 91.44,42.86 90.81,43.5 90.81,46.67 92.71,46.67 92.71,42.86 92.39,42.55
N$29
  pour Bottom (isolate 0.305): 84.45,48.9 79.38,48.9 78.11,47.62 78.11,46.67 79.06,45.72 85.09,45.72 85.41,45.4 85.41,43.5 86.04,42.55 87,42.55 87.63,43.5 87.63,45.09 86.68,46.04 86.68,47.94 89.53,50.8 89.53,53.02 89.22,53.34 87,53.34 86.68,53.02 86.68,51.12
N$30  (7 unrouted)
N$31
  Bottom 0.406: IC1.19 46.11,21.52 47.31,20.32 47.31,6.35 SV1.9
N$32
  Bottom 0.406: IC1.22 44.7,19.12 45.4,18.41 45.4,10.48 44.77,9.84 44.77,6.35 SV1.7
N$33
  Bottom 0.61: U$13.1 71.2,15.48 71.44,15.24 C23.1
N$34
  pour Bottom (isolate 0.61): 76.2,17.14 76.2,16.51 75.88,16.19 74.61,16.19 74.61,5.71 75.25,5.08 78.42,5.08 79.06,5.71 79.06,13.34 79.69,13.97 83.19,13.97 83.19,16.51 82.55,17.14
N$35
  Bottom 0.305: U$11.2A 80.02,51.63
  pour Bottom (isolate 0.406): 79.69,50.16 83.82,50.16 85.41,51.75 85.41,53.34 87.63,55.88 87.63,59.05 84.45,59.05 84.45,55.88 83.82,55.24 78.74,55.24 78.11,54.61 78.11,51.75
N$36
  pour Bottom (isolate 0.406): 60.64,50.16 64.77,50.16 66.36,51.75 66.36,53.34 68.58,55.88 68.58,59.05 65.41,59.05 65.41,55.88 64.77,55.24 59.69,55.24 59.05,54.61 59.05,51.75
RED_DIM
  Bottom 0.305: 74.62,42.24 RED_LM3407.2 | 74.62,42.24 74.93,42.55 R1.2 | 74.62,42.24 74.92,42.24 75.88,41.27
  Bottom 0.406: 75.88,41.27 75.88,32.7 74.93,31.75 63.18,31.75 60.01,28.57 40.64,28.57 39.62,27.55 IC1.14
RST  (via drill 0.61)
  Top 0.305: v32.7,12.06 v51.44,12.06
  Bottom 0.305: U$7.5 52.07,12.7 v51.44,12.06
  Bottom 0.406: IC1.29 38.02,13.57 36.51,12.06 v32.7,12.06 30.16,14.61 23.18,14.61 22.23,13.65 22.23,12.75 R4.1 19.09,12.7 S1.3 S1.4 10.76,11.43 JP1.1
SCK  (via drill 0.61)
  Top 0.305: v48.9,23.81 v48.9,17.78
  Bottom 0.406: IC1.17 48.84,23.12 v48.9,23.81 | v48.9,17.78 U$7.3
SW1
  Bottom 0.406: IC1.27 39.62,12.63 35.88,8.89 33.02,8.89 30.48,6.35 JP8.2
SW2
  Bottom 0.406: IC1.28 38.82,13.1 35.88,10.16 33.02,10.16 30.48,7.62 16.51,7.62 15.24,6.35 JP7.2
VHI  (via drill 0.61)
  Top 0.305: v86.04,36.2 v99.06,36.2 | v9.84,36.2 v27.94,36.2 | v28.89,36.2 v46.99,36.2 | v47.94,36.2 v66.04,36.2 | v66.99,36.2 v85.09,36.2
  Bottom 0.305: 82.87,35.43 C19.1
  Bottom 0.914: D5.C 92.71,52.14
  pour Bottom (isolate 0.406): 83.5,56.83 83.5,59.69 84.14,60.33 87.95,60.33 88.58,59.69 88.58,56.2 89.22,55.56 90.49,55.56 91.44,54.61 91.44,51.12 92.08,50.48 93.98,50.48 94.3,50.8 94.3,58.42 90.49,62.23 71.44,62.23 75.25,58.42 75.25,55.88 75.56,56.52 83.19,56.52
  pour Bottom (isolate 0.305): 87.63,41.27 82.87,41.27 82.87,34.61 84.77,34.61 85.09,34.92 86.04,34.92 86.68,35.56 86.68,40.01 87.31,40.01 87.63,40.32
  pour Bottom (isolate 0.61): 83.19,18.41 75.88,18.41 75.88,18.73 80.33,18.73 81.28,19.68 89.53,19.68 89.53,24.13 93.98,24.13 94.61,23.5 94.61,17.14 84.14,17.14
  pour Bottom (isolate 0.61): 95.25,28.26 90.17,28.26 89.53,27.62 89.53,23.5 89.85,23.18 101.6,23.18 101.6,52.07 93.03,59.69 93.03,50.48 96.52,50.48 97.47,49.53 97.47,30.48 96.52,29.53
  pour Bottom (isolate 0.406): 64.45,56.83 64.45,59.69 65.09,60.33 68.9,60.33 69.53,59.69 69.53,56.2 70.17,55.56 71.44,55.56 72.39,54.61 72.39,51.12 73.03,50.48 74.93,50.48 75.25,50.8 75.25,58.42 71.44,62.23 52.39,62.23 56.2,58.42 56.2,55.88 56.52,56.52 64.14,56.52
  pour Bottom (isolate 0.406): 45.4,56.83 45.4,59.69 46.04,60.33 49.85,60.33 50.48,59.69 50.48,56.2 51.12,55.56 52.39,55.56 53.34,54.61 53.34,51.12 53.98,50.48 55.88,50.48 56.2,50.8 56.2,58.42 52.39,62.23 33.34,62.23 37.15,58.42 37.15,55.88 37.47,56.52 45.09,56.52
  pour Bottom (isolate 0.406): 26.35,56.83 26.35,59.69 26.99,60.33 30.8,60.33 31.43,59.69 31.43,56.2 32.07,55.56 33.34,55.56 34.29,54.61 34.29,51.12 34.92,50.48 36.83,50.48 37.15,50.8 37.15,58.42 33.34,62.23 14.29,62.23 18.1,58.42 18.1,55.88 18.41,56.52 26.04,56.52
  pour Bottom (isolate 0.406): 7.3,56.83 7.3,59.69 7.94,60.33 11.75,60.33 12.38,59.69 12.38,56.2 13.02,55.56 14.29,55.56 15.24,54.61 15.24,51.12 15.88,50.48 17.78,50.48 18.1,50.8 18.1,58.42 14.29,62.23 1.59,62.23 1.59,56.52 6.99,56.52
  pour Bottom (isolate 0.305): 68.58,41.27 63.82,41.27 63.82,34.61 65.72,34.61 66.04,34.92 66.99,34.92 67.63,35.56 67.63,40.01 68.26,40.01 68.58,40.32
  pour Bottom (isolate 0.305): 49.53,41.27 44.77,41.27 44.77,34.61 46.67,34.61 46.99,34.92 47.94,34.92 48.58,35.56 48.58,40.01 49.21,40.01 49.53,40.32
  pour Bottom (isolate 0.305): 30.48,41.27 25.72,41.27 25.72,34.61 27.62,34.61 27.94,34.92 28.89,34.92 29.53,35.56 29.53,40.01 30.16,40.01 30.48,40.32
  pour Bottom (isolate 0.305): 11.43,41.27 6.67,41.27 6.67,34.61 8.57,34.61 8.89,34.92 9.84,34.92 10.48,35.56 10.48,40.01 11.11,40.01 11.43,40.32
WW2_DIM
  Bottom 0.305: 93.67,42.24 93.98,42.55 R10.2 | 93.67,42.24 93.97,42.24 94.93,41.27 | 93.67,42.24 RED_LM4.2
  Bottom 0.406: 94.93,41.27 94.93,32.38 94.3,31.75 77.79,31.75 76.52,30.48 66.36,30.48 63.5,27.62 59.05,27.62 R6.P$1 57.15,27.62 41.27,27.62 40.42,26.77 IC1.15
WW_DIM
  Bottom 0.305: 17.48,42.24 17.78,42.55 R7.2 | 17.48,42.24 17.77,42.24 18.73,41.27 | 17.48,42.24 RED_LM3.2
  Bottom 0.406: IC1.1 23.44,17.52 20.64,20.32 18.1,20.32 15.56,22.86 15.56,31.11 18.73,34.29 18.73,41.27